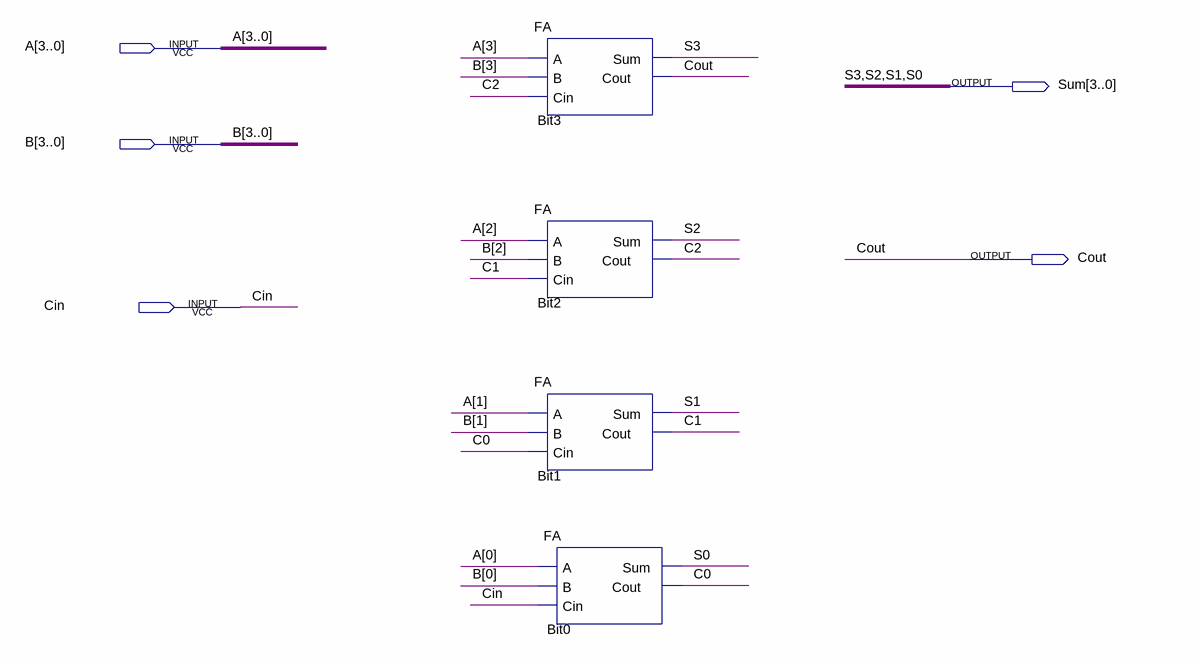
[diagram p0: schematic sheet]
// Quartus schematic adder_4bit.bdf as structural Verilog: 4 symbols, 5 pins
module adder_4bit (
  input  [3:0] A,
  input  [3:0] B,
  input  Cin,
  output [3:0] Sum,
  output Cout
);

  wire C0, C1, C2;

  FA Bit3 (.A(A[3]), .B(B[3]), .Cin(C2), .Sum(Sum[3]), .Cout(Cout));
  FA Bit2 (.A(A[2]), .B(B[2]), .Cin(C1), .Sum(Sum[2]), .Cout(C2));
  FA Bit1 (.A(A[1]), .B(B[1]), .Cin(C0), .Sum(Sum[1]), .Cout(C1));
  FA Bit0 (.A(A[0]), .B(B[0]), .Cin(Cin), .Sum(Sum[0]), .Cout(C0));

  // Other names for the same wires on the sheet: S0 = Sum[0]; S1 = Sum[1]; S2 = Sum[2]; S3 = Sum[3]
endmodule
